# Altium schematic sheet cube8.SchDoc: CUBE 8
size Letter; DrawnBy: Xinhang Liu; SheetNumber: 1; SheetTotal: 1
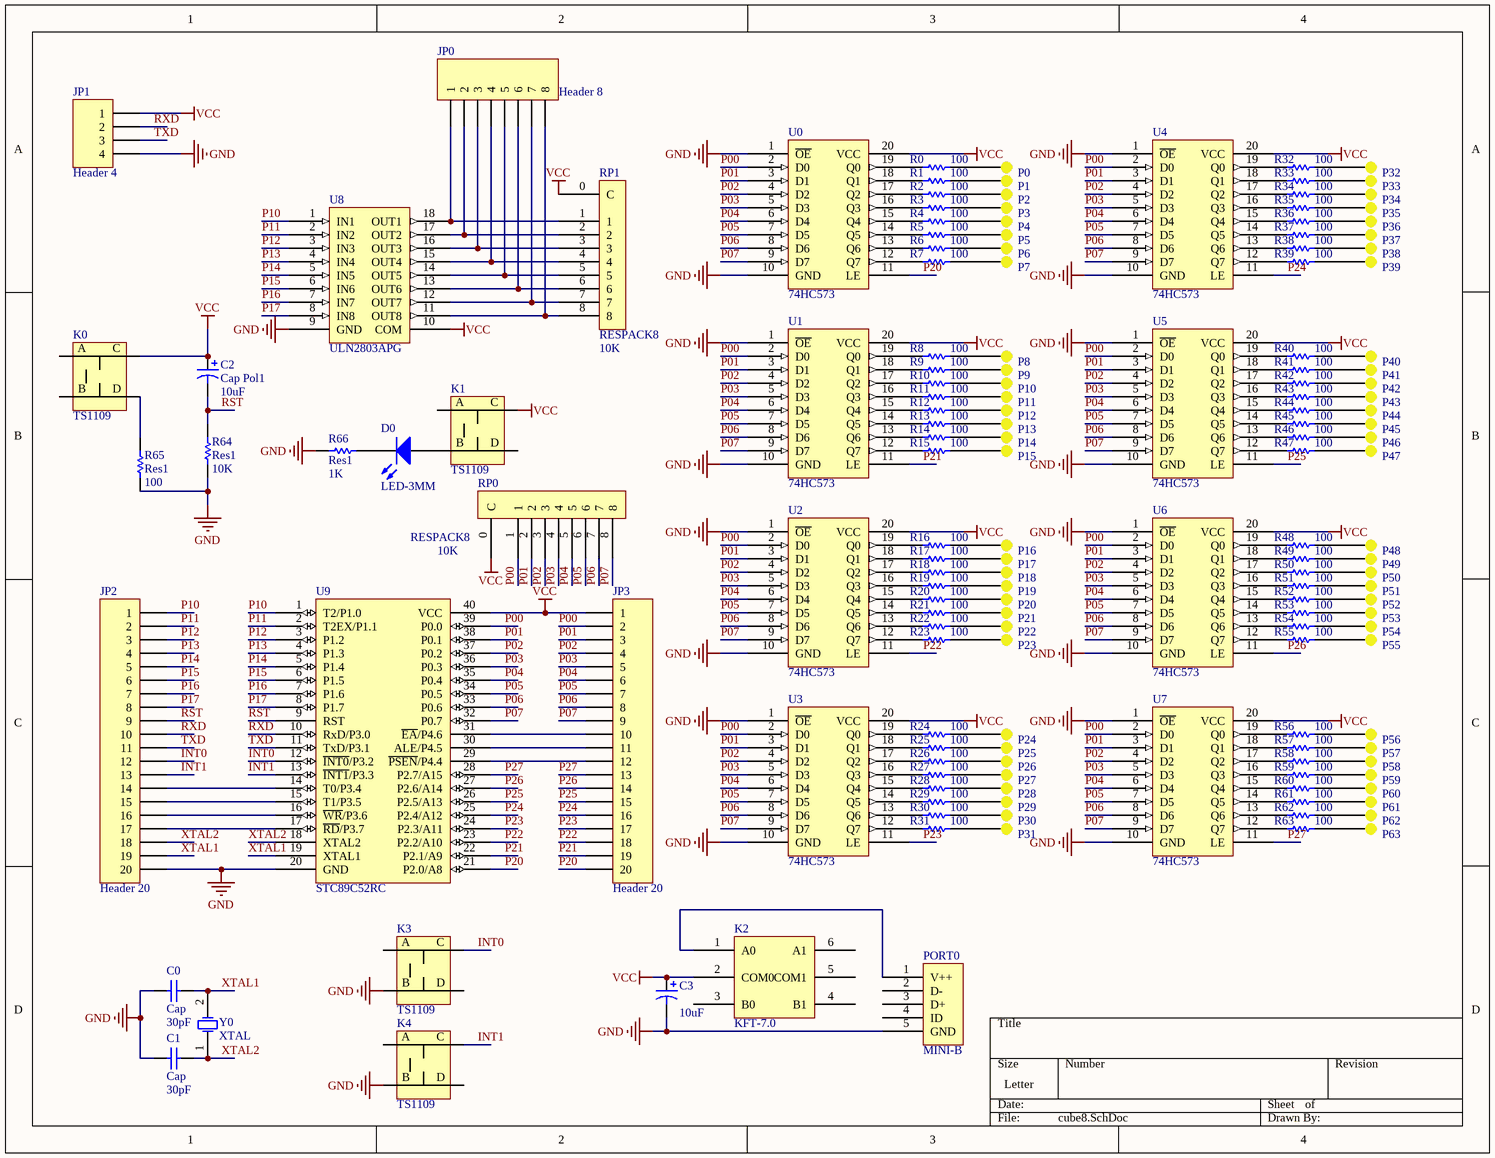
[diagram p0: cube8.SchDoc]

## Parts
C0  Cap  value 30pF  [RAD-0.1]
C1  Cap  value 30pF  [RAD-0.1]
C2  Cap Pol1  value 10uF  [RB.1]
C3  value 10uF  [RB.1]  (hidden comment: Cap Pol1)
D0  LED-3MM  [LED3]
JP0  Header 8  [HDR1X8]
JP1  Header 4  [PIN4]
JP2  Header 20  [HDR1X20]
JP3  Header 20  [HDR1X20]
K0  TS1109  [TS-1109]
K1  TS1109  [TS-1109]
K2  KFT-7.0  [KFT-7.0]
K3  TS1109  [TS-1109]
K4  TS1109  [TS-1109]
P0  PIN  [PIN1]  (value not drawn)
P1  PIN  [PIN1]  (value not drawn)
P2  PIN  [PIN1]  (value not drawn)
P3  PIN  [PIN1]  (value not drawn)
P4  PIN  [PIN1]  (value not drawn)
P5  PIN  [PIN1]  (value not drawn)
P6  PIN  [PIN1]  (value not drawn)
P7  PIN  [PIN1]  (value not drawn)
P8  PIN  [PIN1]  (value not drawn)
P9  PIN  [PIN1]  (value not drawn)
P10  PIN  [PIN1]  (value not drawn)
P11  PIN  [PIN1]  (value not drawn)
P12  PIN  [PIN1]  (value not drawn)
P13  PIN  [PIN1]  (value not drawn)
P14  PIN  [PIN1]  (value not drawn)
P15  PIN  [PIN1]  (value not drawn)
P16  PIN  [PIN1]  (value not drawn)
P17  PIN  [PIN1]  (value not drawn)
P18  PIN  [PIN1]  (value not drawn)
P19  PIN  [PIN1]  (value not drawn)
P20  PIN  [PIN1]  (value not drawn)
P21  PIN  [PIN1]  (value not drawn)
P22  PIN  [PIN1]  (value not drawn)
P23  PIN  [PIN1]  (value not drawn)
P24  PIN  [PIN1]  (value not drawn)
P25  PIN  [PIN1]  (value not drawn)
P26  PIN  [PIN1]  (value not drawn)
P27  PIN  [PIN1]  (value not drawn)
P28  PIN  [PIN1]  (value not drawn)
P29  PIN  [PIN1]  (value not drawn)
P30  PIN  [PIN1]  (value not drawn)
P31  PIN  [PIN1]  (value not drawn)
P32  PIN  [PIN1]  (value not drawn)
P33  PIN  [PIN1]  (value not drawn)
P34  PIN  [PIN1]  (value not drawn)
P35  PIN  [PIN1]  (value not drawn)
P36  PIN  [PIN1]  (value not drawn)
P37  PIN  [PIN1]  (value not drawn)
P38  PIN  [PIN1]  (value not drawn)
P39  PIN  [PIN1]  (value not drawn)
P40  PIN  [PIN1]  (value not drawn)
P41  PIN  [PIN1]  (value not drawn)
P42  PIN  [PIN1]  (value not drawn)
P43  PIN  [PIN1]  (value not drawn)
P44  PIN  [PIN1]  (value not drawn)
P45  PIN  [PIN1]  (value not drawn)
P46  PIN  [PIN1]  (value not drawn)
P47  PIN  [PIN1]  (value not drawn)
P48  PIN  [PIN1]  (value not drawn)
P49  PIN  [PIN1]  (value not drawn)
P50  PIN  [PIN1]  (value not drawn)
P51  PIN  [PIN1]  (value not drawn)
P52  PIN  [PIN1]  (value not drawn)
P53  PIN  [PIN1]  (value not drawn)
P54  PIN  [PIN1]  (value not drawn)
P55  PIN  [PIN1]  (value not drawn)
P56  PIN  [PIN1]  (value not drawn)
P57  PIN  [PIN1]  (value not drawn)
P58  PIN  [PIN1]  (value not drawn)
P59  PIN  [PIN1]  (value not drawn)
P60  PIN  [PIN1]  (value not drawn)
P61  PIN  [PIN1]  (value not drawn)
P62  PIN  [PIN1]  (value not drawn)
P63  PIN  [PIN1]  (value not drawn)
PORT0  MINI-B  [MINI-B]
R0  value 100  [AXIAL-0.3]  (hidden comment: Res1)
R1  value 100  [AXIAL-0.3]  (hidden comment: Res1)
R2  value 100  [AXIAL-0.3]  (hidden comment: Res1)
R3  value 100  [AXIAL-0.3]  (hidden comment: Res1)
R4  value 100  [AXIAL-0.3]  (hidden comment: Res1)
R5  value 100  [AXIAL-0.3]  (hidden comment: Res1)
R6  value 100  [AXIAL-0.3]  (hidden comment: Res1)
R7  value 100  [AXIAL-0.3]  (hidden comment: Res1)
R8  value 100  [AXIAL-0.3]  (hidden comment: Res1)
R9  value 100  [AXIAL-0.3]  (hidden comment: Res1)
R10  value 100  [AXIAL-0.3]  (hidden comment: Res1)
R11  value 100  [AXIAL-0.3]  (hidden comment: Res1)
R12  value 100  [AXIAL-0.3]  (hidden comment: Res1)
R13  value 100  [AXIAL-0.3]  (hidden comment: Res1)
R14  value 100  [AXIAL-0.3]  (hidden comment: Res1)
R15  value 100  [AXIAL-0.3]  (hidden comment: Res1)
R16  value 100  [AXIAL-0.3]  (hidden comment: Res1)
R17  value 100  [AXIAL-0.3]  (hidden comment: Res1)
R18  value 100  [AXIAL-0.3]  (hidden comment: Res1)
R19  value 100  [AXIAL-0.3]  (hidden comment: Res1)
R20  value 100  [AXIAL-0.3]  (hidden comment: Res1)
R21  value 100  [AXIAL-0.3]  (hidden comment: Res1)
R22  value 100  [AXIAL-0.3]  (hidden comment: Res1)
R23  value 100  [AXIAL-0.3]  (hidden comment: Res1)
R24  value 100  [AXIAL-0.3]  (hidden comment: Res1)
R25  value 100  [AXIAL-0.3]  (hidden comment: Res1)
R26  value 100  [AXIAL-0.3]  (hidden comment: Res1)
R27  value 100  [AXIAL-0.3]  (hidden comment: Res1)
R28  value 100  [AXIAL-0.3]  (hidden comment: Res1)
R29  value 100  [AXIAL-0.3]  (hidden comment: Res1)
R30  value 100  [AXIAL-0.3]  (hidden comment: Res1)
R31  value 100  [AXIAL-0.3]  (hidden comment: Res1)
R32  value 100  [AXIAL-0.3]  (hidden comment: Res1)
R33  value 100  [AXIAL-0.3]  (hidden comment: Res1)
R34  value 100  [AXIAL-0.3]  (hidden comment: Res1)
R35  value 100  [AXIAL-0.3]  (hidden comment: Res1)
R36  value 100  [AXIAL-0.3]  (hidden comment: Res1)
R37  value 100  [AXIAL-0.3]  (hidden comment: Res1)
R38  value 100  [AXIAL-0.3]  (hidden comment: Res1)
R39  value 100  [AXIAL-0.3]  (hidden comment: Res1)
R40  value 100  [AXIAL-0.3]  (hidden comment: Res1)
R41  value 100  [AXIAL-0.3]  (hidden comment: Res1)
R42  value 100  [AXIAL-0.3]  (hidden comment: Res1)
R43  value 100  [AXIAL-0.3]  (hidden comment: Res1)
R44  value 100  [AXIAL-0.3]  (hidden comment: Res1)
R45  value 100  [AXIAL-0.3]  (hidden comment: Res1)
R46  value 100  [AXIAL-0.3]  (hidden comment: Res1)
R47  value 100  [AXIAL-0.3]  (hidden comment: Res1)
R48  value 100  [AXIAL-0.3]  (hidden comment: Res1)
R49  value 100  [AXIAL-0.3]  (hidden comment: Res1)
R50  value 100  [AXIAL-0.3]  (hidden comment: Res1)
R51  value 100  [AXIAL-0.3]  (hidden comment: Res1)
R52  value 100  [AXIAL-0.3]  (hidden comment: Res1)
R53  value 100  [AXIAL-0.3]  (hidden comment: Res1)
R54  value 100  [AXIAL-0.3]  (hidden comment: Res1)
R55  value 100  [AXIAL-0.3]  (hidden comment: Res1)
R56  value 100  [AXIAL-0.3]  (hidden comment: Res1)
R57  value 100  [AXIAL-0.3]  (hidden comment: Res1)
R58  value 100  [AXIAL-0.3]  (hidden comment: Res1)
R59  value 100  [AXIAL-0.3]  (hidden comment: Res1)
R60  value 100  [AXIAL-0.3]  (hidden comment: Res1)
R61  value 100  [AXIAL-0.3]  (hidden comment: Res1)
R62  value 100  [AXIAL-0.3]  (hidden comment: Res1)
R63  value 100  [AXIAL-0.3]  (hidden comment: Res1)
R64  Res1  value 10K  [AXIAL-0.3]
R65  Res1  value 100  [AXIAL-0.3]
R66  Res1  value 1K  [AXIAL-0.3]
RP0  RESPACK8  value 10K  [SIP9]
RP1  RESPACK8  value 10K  [SIP9]
U0  74HC573  [DIP20]
U1  74HC573  [DIP20]
U2  74HC573  [DIP20]
U3  74HC573  [DIP20]
U4  74HC573  [DIP20]
U5  74HC573  [DIP20]
U6  74HC573  [DIP20]
U7  74HC573  [DIP20]
U8  ULN2803APG  [DIP18]
U9  STC89C52RC  [DIP40]
Y0  XTAL  [HC-49S]

## Nets
GND: C0.1 C1.1 C3.2 JP1.4 JP2.20 K3.B(D) K4.B(D) PORT0.5(GND) R64.1 R65.1 R66.2 U0.1(~{OE}) U0.10(GND) U1.1(~{OE}) U1.10(GND) U2.1(~{OE}) U2.10(GND) U3.1(~{OE}) U3.10(GND) U4.1(~{OE}) U4.10(GND) U5.1(~{OE}) U5.10(GND) U6.1(~{OE}) U6.10(GND) U7.1(~{OE}) U7.10(GND) U8.9(GND) U9.20(GND)
VCC: C2.1 C3.1 JP1.1 JP3.1 K0.C K1.C K2.2(COM0) RP0.0(C) RP1.0(C) U0.20(VCC) U1.20(VCC) U2.20(VCC) U3.20(VCC) U4.20(VCC) U5.20(VCC) U6.20(VCC) U7.20(VCC) U8.10(COM) U9.40(VCC)
INT0: JP2.12 K3.C U9.12(~{INT0}/P3.2)
INT1: JP2.13 K4.C U9.13(~{INT1}/P3.3)
P00: JP3.2 RP0.1 U0.2(D0) U1.2(D0) U2.2(D0) U3.2(D0) U4.2(D0) U5.2(D0) U6.2(D0) U7.2(D0) U9.39(P0.0)
P01: JP3.3 RP0.2 U0.3(D1) U1.3(D1) U2.3(D1) U3.3(D1) U4.3(D1) U5.3(D1) U6.3(D1) U7.3(D1) U9.38(P0.1)
P02: JP3.4 RP0.3 U0.4(D2) U1.4(D2) U2.4(D2) U3.4(D2) U4.4(D2) U5.4(D2) U6.4(D2) U7.4(D2) U9.37(P0.2)
P03: JP3.5 RP0.4 U0.5(D3) U1.5(D3) U2.5(D3) U3.5(D3) U4.5(D3) U5.5(D3) U6.5(D3) U7.5(D3) U9.36(P0.3)
P04: JP3.6 RP0.5 U0.6(D4) U1.6(D4) U2.6(D4) U3.6(D4) U4.6(D4) U5.6(D4) U6.6(D4) U7.6(D4) U9.35(P0.4)
P05: JP3.7 RP0.6 U0.7(D5) U1.7(D5) U2.7(D5) U3.7(D5) U4.7(D5) U5.7(D5) U6.7(D5) U7.7(D5) U9.34(P0.5)
P06: JP3.8 RP0.7 U0.8(D6) U1.8(D6) U2.8(D6) U3.8(D6) U4.8(D6) U5.8(D6) U6.8(D6) U7.8(D6) U9.33(P0.6)
P07: JP3.9 RP0.8 U0.9(D7) U1.9(D7) U2.9(D7) U3.9(D7) U4.9(D7) U5.9(D7) U6.9(D7) U7.9(D7) U9.32(P0.7)
P10: JP2.1 U8.1(IN1) U9.1(T2/P1.0)
P11: JP2.2 U8.2(IN2) U9.2(T2EX/P1.1)
P12: JP2.3 U8.3(IN3) U9.3(P1.2)
P13: JP2.4 U8.4(IN4) U9.4(P1.3)
P14: JP2.5 U8.5(IN5) U9.5(P1.4)
P15: JP2.6 U8.6(IN6) U9.6(P1.5)
P16: JP2.7 U8.7(IN7) U9.7(P1.6)
P17: JP2.8 U8.8(IN8) U9.8(P1.7)
P20: JP3.20 U0.11(LE) U9.21(P2.0/A8)
P21: JP3.19 U1.11(LE) U9.22(P2.1/A9)
P22: JP3.18 U2.11(LE) U9.23(P2.2/A10)
P23: JP3.17 U3.11(LE) U9.24(P2.3/A11)
P24: JP3.16 U4.11(LE) U9.25(P2.4/A12)
P25: JP3.15 U5.11(LE) U9.26(P2.5/A13)
P26: JP3.14 U6.11(LE) U9.27(P2.6/A14)
P27: JP3.13 U7.11(LE) U9.28(P2.7/A15)
RST: C2.2 JP2.9 R64.2 U9.9(RST)
RXD: JP1.2 JP2.10 U9.10(RxD/P3.0)
TXD: JP1.3 JP2.11 U9.11(TxD/P3.1)
XTAL1: C0.2 JP2.19 U9.19(XTAL1) Y0.2(OSC2)
XTAL2: C1.2 JP2.18 U9.18(XTAL2) Y0.1(OSC1)
NetD0_1: D0.1(A) K1.B(D)
NetD0_2: D0.2(K) R66.1
NetJP0_1: JP0.1 RP1.1 U8.18(OUT1)
NetJP0_2: JP0.2 RP1.2 U8.17(OUT2)
NetJP0_3: JP0.3 RP1.3 U8.16(OUT3)
NetJP0_4: JP0.4 RP1.4 U8.15(OUT4)
NetJP0_5: JP0.5 RP1.5 U8.14(OUT5)
NetJP0_6: JP0.6 RP1.6 U8.13(OUT6)
NetJP0_7: JP0.7 RP1.7 U8.12(OUT7)
NetJP0_8: JP0.8 RP1.8 U8.11(OUT8)
NetJP2_14: JP2.14 U9.14(T0/P3.4)
NetJP2_15: JP2.15 U9.15(T1/P3.5)
NetJP2_16: JP2.16 U9.16(~{WR}/P3.6)
NetJP2_17: JP2.17 U9.17(~{RD}/P3.7)
NetJP3_10: JP3.10 U9.31(~{EA}/P4.6)
NetJP3_11: JP3.11 U9.30(ALE/P4.5)
NetJP3_12: JP3.12 U9.29(~{PSEN}/P4.4)
NetK0_D: K0.D R65.2
NetK2_1: K2.1(A0) PORT0.1(V++)
NetP0_0: P0.0(P) R0.2
NetP1_0: P1.0(P) R1.2
NetP2_0: P2.0(P) R2.2
NetP3_0: P3.0(P) R3.2
NetP4_0: P4.0(P) R4.2
NetP5_0: P5.0(P) R5.2
NetP6_0: P6.0(P) R6.2
NetP7_0: P7.0(P) R7.2
NetP8_0: P8.0(P) R8.2
NetP9_0: P9.0(P) R9.2
NetP10_0: P10.0(P) R10.2
NetP11_0: P11.0(P) R11.2
NetP12_0: P12.0(P) R12.2
NetP13_0: P13.0(P) R13.2
NetP14_0: P14.0(P) R14.2
NetP15_0: P15.0(P) R15.2
NetP16_0: P16.0(P) R16.2
NetP17_0: P17.0(P) R17.2
NetP18_0: P18.0(P) R18.2
NetP19_0: P19.0(P) R19.2
NetP20_0: P20.0(P) R20.2
NetP21_0: P21.0(P) R21.2
NetP22_0: P22.0(P) R22.2
NetP23_0: P23.0(P) R23.2
NetP24_0: P24.0(P) R24.2
NetP25_0: P25.0(P) R25.2
NetP26_0: P26.0(P) R26.2
NetP27_0: P27.0(P) R27.2
NetP28_0: P28.0(P) R28.2
NetP29_0: P29.0(P) R29.2
NetP30_0: P30.0(P) R30.2
NetP31_0: P31.0(P) R31.2
NetP32_0: P32.0(P) R32.2
NetP33_0: P33.0(P) R33.2
NetP34_0: P34.0(P) R34.2
NetP35_0: P35.0(P) R35.2
NetP36_0: P36.0(P) R36.2
NetP37_0: P37.0(P) R37.2
NetP38_0: P38.0(P) R38.2
NetP39_0: P39.0(P) R39.2
NetP40_0: P40.0(P) R40.2
NetP41_0: P41.0(P) R41.2
NetP42_0: P42.0(P) R42.2
NetP43_0: P43.0(P) R43.2
NetP44_0: P44.0(P) R44.2
NetP45_0: P45.0(P) R45.2
NetP46_0: P46.0(P) R46.2
NetP47_0: P47.0(P) R47.2
NetP48_0: P48.0(P) R48.2
NetP49_0: P49.0(P) R49.2
NetP50_0: P50.0(P) R50.2
NetP51_0: P51.0(P) R51.2
NetP52_0: P52.0(P) R52.2
NetP53_0: P53.0(P) R53.2
NetP54_0: P54.0(P) R54.2
NetP55_0: P55.0(P) R55.2
NetP56_0: P56.0(P) R56.2
NetP57_0: P57.0(P) R57.2
NetP58_0: P58.0(P) R58.2
NetP59_0: P59.0(P) R59.2
NetP60_0: P60.0(P) R60.2
NetP61_0: P61.0(P) R61.2
NetP62_0: P62.0(P) R62.2
NetP63_0: P63.0(P) R63.2
NetR0_1: R0.1 U0.19(Q0)
NetR1_1: R1.1 U0.18(Q1)
NetR2_1: R2.1 U0.17(Q2)
NetR3_1: R3.1 U0.16(Q3)
NetR4_1: R4.1 U0.15(Q4)
NetR5_1: R5.1 U0.14(Q5)
NetR6_1: R6.1 U0.13(Q6)
NetR7_1: R7.1 U0.12(Q7)
NetR8_1: R8.1 U1.19(Q0)
NetR9_1: R9.1 U1.18(Q1)
NetR10_1: R10.1 U1.17(Q2)
NetR11_1: R11.1 U1.16(Q3)
NetR12_1: R12.1 U1.15(Q4)
NetR13_1: R13.1 U1.14(Q5)
NetR14_1: R14.1 U1.13(Q6)
NetR15_1: R15.1 U1.12(Q7)
NetR16_1: R16.1 U2.19(Q0)
NetR17_1: R17.1 U2.18(Q1)
NetR18_1: R18.1 U2.17(Q2)
NetR19_1: R19.1 U2.16(Q3)
NetR20_1: R20.1 U2.15(Q4)
NetR21_1: R21.1 U2.14(Q5)
NetR22_1: R22.1 U2.13(Q6)
NetR23_1: R23.1 U2.12(Q7)
NetR24_1: R24.1 U3.19(Q0)
NetR25_1: R25.1 U3.18(Q1)
NetR26_1: R26.1 U3.17(Q2)
NetR27_1: R27.1 U3.16(Q3)
NetR28_1: R28.1 U3.15(Q4)
NetR29_1: R29.1 U3.14(Q5)
NetR30_1: R30.1 U3.13(Q6)
NetR31_1: R31.1 U3.12(Q7)
NetR32_1: R32.1 U4.19(Q0)
NetR33_1: R33.1 U4.18(Q1)
NetR34_1: R34.1 U4.17(Q2)
NetR35_1: R35.1 U4.16(Q3)
NetR36_1: R36.1 U4.15(Q4)
NetR37_1: R37.1 U4.14(Q5)
NetR38_1: R38.1 U4.13(Q6)
NetR39_1: R39.1 U4.12(Q7)
NetR40_1: R40.1 U5.19(Q0)
NetR41_1: R41.1 U5.18(Q1)
NetR42_1: R42.1 U5.17(Q2)
NetR43_1: R43.1 U5.16(Q3)
NetR44_1: R44.1 U5.15(Q4)
NetR45_1: R45.1 U5.14(Q5)
NetR46_1: R46.1 U5.13(Q6)
NetR47_1: R47.1 U5.12(Q7)
NetR48_1: R48.1 U6.19(Q0)
NetR49_1: R49.1 U6.18(Q1)
NetR50_1: R50.1 U6.17(Q2)
NetR51_1: R51.1 U6.16(Q3)
NetR52_1: R52.1 U6.15(Q4)
NetR53_1: R53.1 U6.14(Q5)
NetR54_1: R54.1 U6.13(Q6)
NetR55_1: R55.1 U6.12(Q7)
NetR56_1: R56.1 U7.19(Q0)
NetR57_1: R57.1 U7.18(Q1)
NetR58_1: R58.1 U7.17(Q2)
NetR59_1: R59.1 U7.16(Q3)
NetR60_1: R60.1 U7.15(Q4)
NetR61_1: R61.1 U7.14(Q5)
NetR62_1: R62.1 U7.13(Q6)
NetR63_1: R63.1 U7.12(Q7)

Not connected (* = marked no-connect by the designer): K0 A(D) B(D); K1 A(D) D(11); K2 3(B0) 4(B1) 5(COM1) 6(A1); K3 A(D) D(11); K4 A(D) D(11); PORT0 2(D-) 3(D+) 4(ID)

## Library data of the parts
C0 C1 = Cap: Capacitor; Published: 8-Jun-2000; LatestRevisionDate: 17-Jul-2002; LatestRevisionNote: Re-released for DXP Platform.; PackageReference: RAD-0.3; Publisher: Altium Limited; PackageDescription: Radial Cap, Thru-Hole; 2 Leads; 0.3 in Pin Spacing
C2 C3 = Cap Pol1: Polarized Capacitor (Radial); Published: 8-Jun-2000; LatestRevisionDate: 17-Jul-2002; LatestRevisionNote: Re-released for DXP Platform.; PackageReference: RB7.6-15; Publisher: Altium Limited; PackageDescription: Polarized Capacitor (Radial); 2 Leads
D0 = LED0: Typical INFRARED GaAs LED; Published: 8-Jun-2000; LatestRevisionDate: 08-Jul-2005; LatestRevisionNote: Mech Layer 1 removed.; PackageReference: LED-0; Publisher: Altium Limited; PackageDescription: LED; 2 Leads
JP0 = Header 8: Header, 8-Pin; LatestRevisionDate: 17-Jul-2002; LatestRevisionNote: Re-released for DXP Platform.; Publisher: Altium Limited
JP1 = Header 4: Header, 4-Pin; LatestRevisionDate: 17-Jul-2002; LatestRevisionNote: Re-released for DXP Platform.; Publisher: Altium Limited
JP2 JP3 = Header 20: Header, 20-Pin; LatestRevisionDate: 17-Jul-2002; LatestRevisionNote: Re-released for DXP Platform.; Publisher: Altium Limited
K0 K1 K3 K4 = TS-1109
P0-P63 = PIN1
R0-R66 = Res1: Resistor; Published: 8-Jun-2000; LatestRevisionDate: 17-Jul-2002; LatestRevisionNote: Re-released for DXP Platform.; PackageReference: AXIAL-0.3; Publisher: Altium Limited; PackageDescription: Axial Device, Thru-Hole; 2 Leads; 0.3 in Pin Spacing
Y0 = XTAL: Crystal Oscillator; Published: 8-Jun-2000; LatestRevisionDate: 17-Jul-2002; LatestRevisionNote: Re-released for DXP Platform.; PackageReference: R38; Publisher: Altium Limited; PackageDescription: Crystal, Thru-Hole; 2 Leads; Body 3.1 x 8.2 mm (Dia.xH)